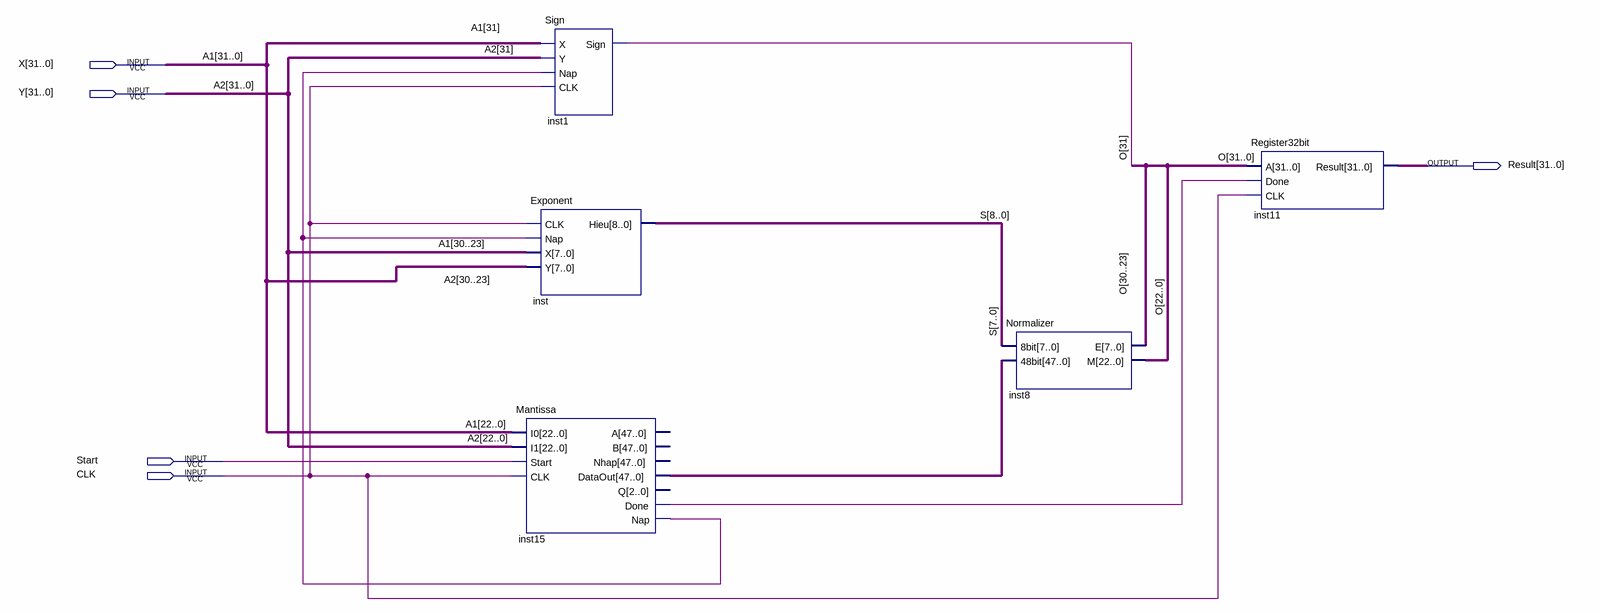
[diagram p0: schematic sheet]
// Quartus schematic FloatingPointMultiplication.bdf as structural Verilog: 5 symbols, 5 pins
module FloatingPointMultiplication (
  input  [31:0] X,
  input  [31:0] Y,
  input  Start,
  input  CLK,
  output [31:0] Result
);

  wire inst15_done, inst15_nap;
  wire [8:0] S;
  wire [31:0] O;
  wire [47:0] inst15_dataout;

  Sign inst1 (.X(X[31]), .Y(Y[31]), .Nap(inst15_nap), .CLK(CLK), .Sign(O[31]));
  Exponent inst (.CLK(CLK), .Nap(inst15_nap), .X(X[30:23]), .Y(Y[30:23]), .Hieu(S));
  Mantissa inst15 (
    .I0(X[22:0]), .I1(Y[22:0]), .Start(Start), .CLK(CLK), .DataOut(inst15_dataout), .Done(inst15_done),
    .Nap(inst15_nap));  // open: A, B, Nhap, Q
  Normalizer inst8 (.\8bit (S[7:0]), .\48bit (inst15_dataout), .E(O[30:23]), .M(O[22:0]));
  Register32bit inst11 (.A(O), .Done(inst15_done), .CLK(CLK), .Result(Result));

  // Other names for the same wires on the sheet: A1[31:0] = X; A2[31:0] = Y
endmodule
